# Altium project try 2.PrjPcb
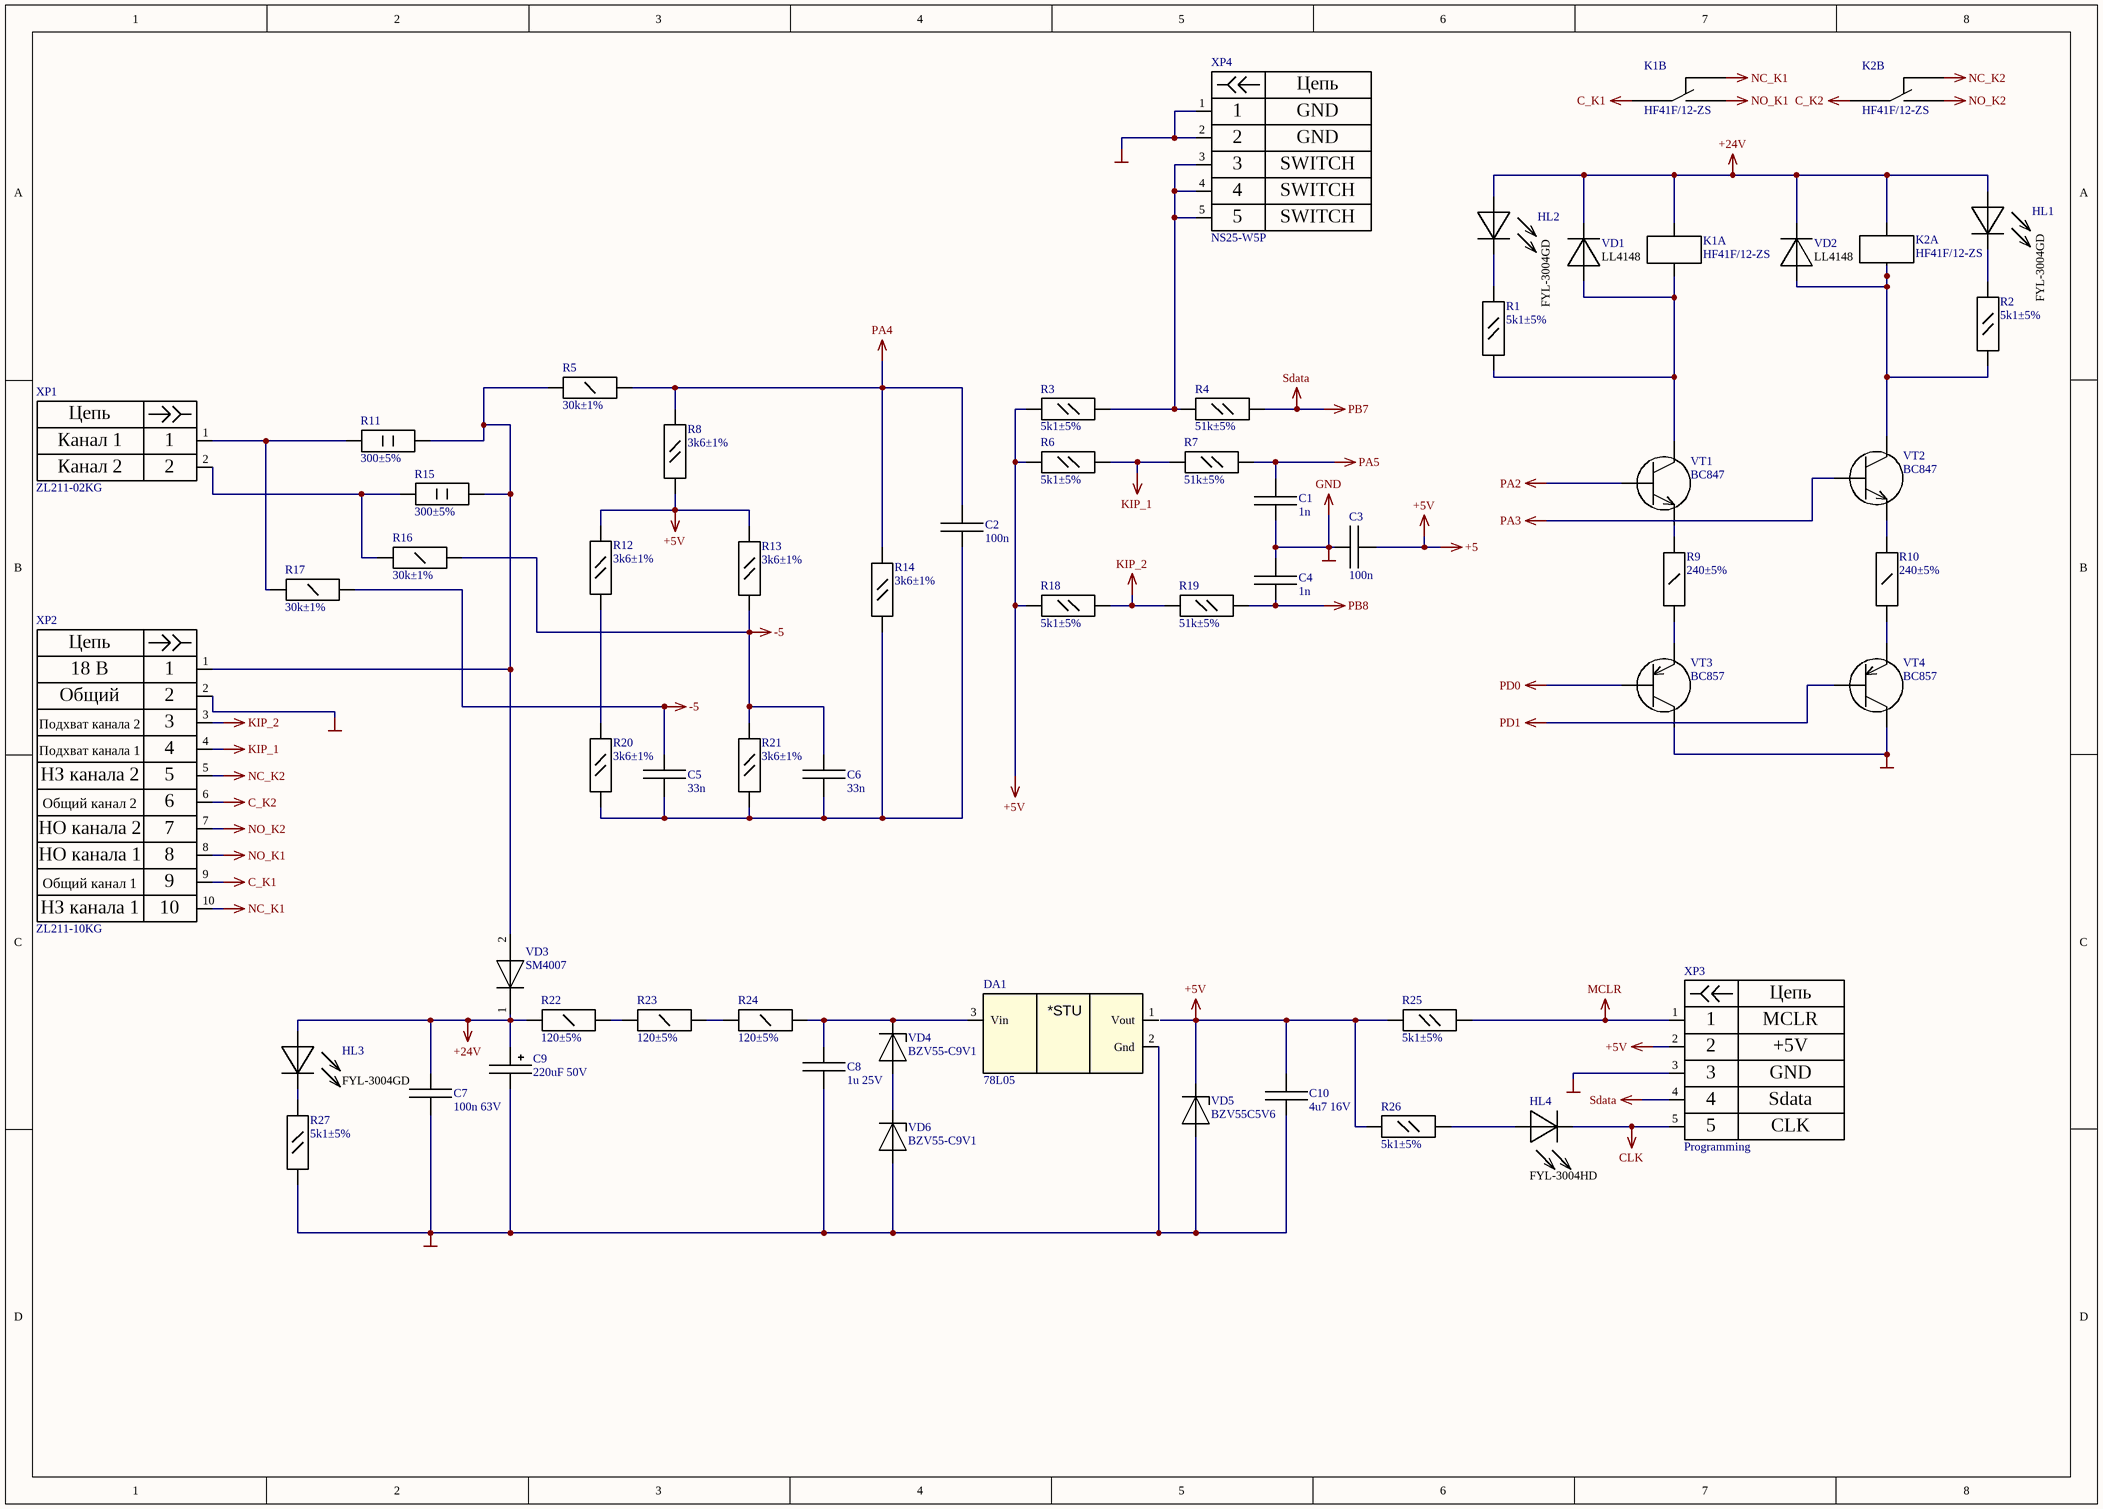
[diagram p0: Sheet2.SchDoc]
2 sheets, 59 parts. Net scope: global (net labels, ports and power ports of the same name join across sheets).
Board file: PCB1.PcbDoc
Sheets:
  Sheet2.SchDoc
  Sheet3.SchDoc

## Sheet Sheet2.SchDoc
size A3; SheetNumber: 1; SheetTotal: 2

### Parts
C1  1n  [Cap Ceramic 0805]
C2  100n  [Cap Ceramic 0805]
C3  100n  [Cap Ceramic 0805]
C4  1n  [Cap Ceramic 0805]
C5  33n  [Cap Ceramic 0805]
C6  33n  [Cap Ceramic 0805]
C7  100n 63V  [Cap Ceramic 0805]
C8  1u 25V  [Cap Ceramic 0805]
C9  220uF 50V  [Cap electro d5x2.05mm]
C10  4u7 16V  [Cap Ceramic 0805]
DA1  78L05  [SOT-89]
HL1  FYL-3004GD  [LED 0805]
HL2  FYL-3004GD  [LED 0805]
HL3  FYL-3004GD  [LED 0805]
HL4  FYL-3004HD  [LED 0805]
K1  HF41F/12-ZS  [HF41F_12-ZS]  (parts A,B of 2)
K2  HF41F/12-ZS  [HF41F_12-ZS]  (parts A,B of 2)
R1  5k1±5%  [Resistor 0805]
R2  5k1±5%  [Resistor 0805]
R3  5k1±5%  [Resistor 0805]
R4  51k±5%  [Resistor 0805]
R5  30k±1%  [Resistor 1206]
R6  5k1±5%  [Resistor 0805]
R7  51k±5%  [Resistor 0805]
R8  3k6±1%  [Resistor 0805]
R9  240±5%  [Resistor 1206]
R10  240±5%  [Resistor 1206]
R11  300±5%  [Resistor 2W d5.08x20.32 axial]
R12  3k6±1%  [Resistor 0805]
R13  3k6±1%  [Resistor 0805]
R14  3k6±1%  [Resistor 0805]
R15  300±5%  [Resistor 2W d5.08x20.32 axial]
R16  30k±1%  [Resistor 1206]
R17  30k±1%  [Resistor 1206]
R18  5k1±5%  [Resistor 0805]
R19  51k±5%  [Resistor 0805]
R20  3k6±1%  [Resistor 0805]
R21  3k6±1%  [Resistor 0805]
R22  120±5%  [Resistor 1206]
R23  120±5%  [Resistor 1206]
R24  120±5%  [Resistor 1206]
R25  5k1±5%  [Resistor 0805]
R26  5k1±5%  [Resistor 0805]
R27  5k1±5%  [Resistor 0805]
VD1  LL4148  [SOD80C]
VD2  LL4148  [SOD80C]
VD3  SM4007  [SM4007]
VD4  BZV55-C9V1  [BZV55C9V1]
VD5  BZV55C5V6  [BZV55C5V6]
VD6  BZV55-C9V1  [BZV55C9V1]
VT1  BC847  [SOT-23-3]
VT2  BC847  [SOT-23-3]
VT3  BC857  [SOT-23-3]
VT4  BC857  [SOT-23-3]
XP1  ZL211-02KG  Name1: Канал 1  Name: Цепь  Name2: Канал 2  [Pins 1x2]
XP2  ZL211-10KG  Name1: 18 В  Name2: Общий  Name3: Подхват канала 2  Name: Цепь  Name4: Подхват канала 1  Name5: НЗ канала 2  Name6: Общий канал 2  Name7: НО канала 2  Name8: НО канала 1  Name9: Общий канал 1  Name10: НЗ канала 1  [Pins 1x10]
XP3  Programming  Name1: MCLR  Name: Цепь  Name2: +5V  Name3: GND  Name4: Sdata  Name5: CLK  [WF-05]
XP4  NS25-W5P  Name1: GND  Name: Цепь  Name3: SWITCH  [WF-05]

### Nets
+5: C3.2 C10.2 R3.1 R6.1 R8.1 R12.2 R13.2 R18.1 R25.1 R26.1 VD5.9 XP3.2  [also labelled +5V]
+24V: C7.1 C9.2 HL1.1(A) HL2.1(A) HL3.1(A) K1.10 K2.10 R22.1 VD1.2(K) VD2.2(K) VD3.1
-5: C1.1 C3.1 C4.2 C5.1 C6.1 C7.2 C8.2 C9.1 C10.1 DA1.2(Gnd) R13.1 R16.2 R17.2 R21.2 R27.1 VD5.8 VD6.8 VT3.3(K) VT4.3(K) XP2.2 XP3.3 XP4.1 XP4.2  [also labelled GND]
C_K1: K1.14 XP2.9
C_K2: K2.14 XP2.6
CLK: HL4.2(K) XP3.5
KIP_1: R6.2 R7.1 XP2.4
KIP_2: R18.2 R19.1 XP2.3
MCLR: R25.2 XP3.1
NC_K1: K1.12 XP2.10
NC_K2: K2.12 XP2.5
NO_K1: K1.13 XP2.8
NO_K2: K2.13 XP2.7
PA2: VT1.1(B)
PA3: VT2.1(B)
PA4: C2.2 R5.2 R8.2 R14.2
PA5: C1.2 R7.2
PB7: R4.2 XP3.4  [also labelled Sdata]
PB8: C4.1 R19.2
PD0: VT3.1(B)
PD1: VT4.1(B)
NetC2_1: C2.1 C5.2 C6.2 R14.1 R20.1 R21.1
NetC8_1: C8.1 DA1.3(Vin) R24.2 VD4.9
NetHL1_2: HL1.2(K) R2.2
NetHL2_2: HL2.2(K) R1.2
NetHL3_2: HL3.2(K) R27.2
NetHL4_1: HL4.1(A) R26.2
NetK1_11: K1.11 R1.1 VD1.1(A) VT1.3(K)
NetK2_11: K2.11 R2.1 VD2.1(A) VT2.3(K)
NetR3_2: R3.2 R4.1 XP4.3 XP4.4 XP4.5
NetR5_1: R5.1 R11.2 R15.2 VD3.2 XP2.1
NetR9_1: R9.1 VT3.2(E)
NetR9_2: R9.2 VT1.2(E)
NetR10_1: R10.1 VT4.2(E)
NetR10_2: R10.2 VT2.2(E)
NetR11_1: R11.1 R17.1 XP1.1
NetR12_1: R12.1 R20.2
NetR15_1: R15.1 R16.1 XP1.2
NetR22_2: R22.2 R23.1
NetR23_2: R23.2 R24.1
NetVD4_8: VD4.8 VD6.9

Not connected (* = marked no-connect by the designer): DA1 1(Vout)

### Notes on the sheet
- (in symbol 78L05) *STU

### Library data of the parts
C1-C8 C10 = CerCap: Comments: *
C9 = ECap: Comments: *
HL1-HL4 = LED: Comments: *
K1 K2 = HF41F_12-ZS
R1-R4 R6-R8 R12-R14 R18-R21 R25-R27 = Resistor 0,125W: Comments: *
R5 R16 R17 = Resistor 0.5W
R9 R10 R22-R24 = Resistor 0,25W: Comments: *
R11 R15 = Resistor 2W: Comments: *
VD4 VD6 = BZV55C9V1
XP1 = Pins 1x2: Comments: *
XP2 = Pins 1x10: Comments: *
XP3 XP4 = Pins 1x5: Comments: *
  XP4: Name2: GND; Name4: SWITCH; Name5: SWITCH
DA1 = 78L05: Comments: *
VD1 VD2 = LL4148: Comments: *
VT1 VT2 = BC847: Comments: *
VT3 VT4 = BC857: Comments: *

## Sheet Sheet3.SchDoc
size A3; SheetNumber: 2; SheetTotal: 2
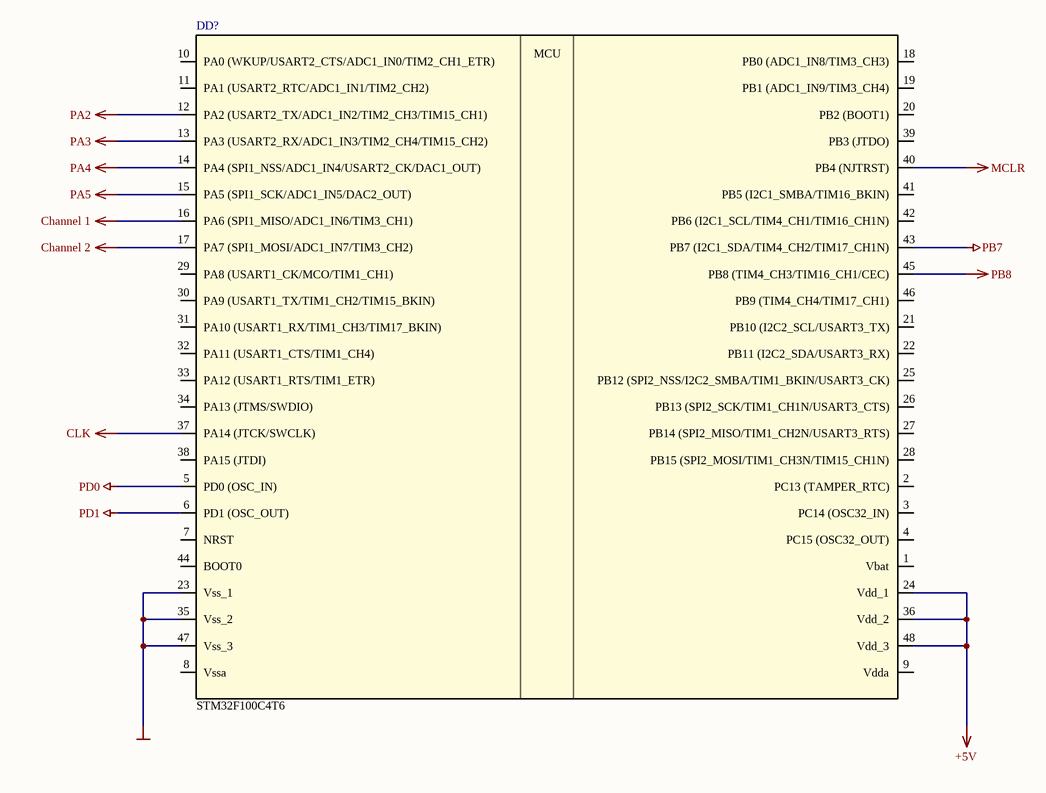
[diagram p1: Sheet3.SchDoc]

### Parts
DD?  STM32F100C4T6  [TQFP48 S0.5]

### Nets
+5V: DD?.24(Vdd_1) DD?.36(Vdd_2) DD?.48(Vdd_3)  [project net +5]
-5: DD?.23(Vss_1) DD?.35(Vss_2) DD?.47(Vss_3)
Channel 1: DD?.16(PA6_(SPI1_MISO/ADC1_IN6/TIM3_CH1))
Channel 2: DD?.17(PA7_(SPI1_MOSI/ADC1_IN7/TIM3_CH2))
CLK: DD?.37(PA14_(JTCK/SWCLK))
MCLR: DD?.40(PB4_(NJTRST))
PA2: DD?.12(PA2_(USART2_TX/ADC1_IN2/TIM2_CH3/TIM15_CH1))
PA3: DD?.13(PA3_(USART2_RX/ADC1_IN3/TIM2_CH4/TIM15_CH2))
PA4: DD?.14(PA4_(SPI1_NSS/ADC1_IN4/USART2_CK/DAC1_OUT))
PA5: DD?.15(PA5_(SPI1_SCK/ADC1_IN5/DAC2_OUT))
PB7: DD?.43(PB7_(I2C1_SDA/TIM4_CH2/TIM17_CH1N))
PB8: DD?.45(PB8_(TIM4_CH3/TIM16_CH1/CEC))
PD0: DD?.5(PD0_(OSC_IN))
PD1: DD?.6(PD1_(OSC_OUT))

Not connected (* = marked no-connect by the designer): DD? 1(Vbat) 2(PC13_(TAMPER_RTC)) 3(PC14_(OSC32_IN)) 4(PC15_(OSC32_OUT)) 7(NRST) 8(Vssa) 9(Vdda) 10(PA0_(WKUP/USART2_CTS/ADC1_IN0/TIM2_CH1_ETR)) 11(PA1_(USART2_RTC/ADC1_IN1/TIM2_CH2)) 18(PB0_(ADC1_IN8/TIM3_CH3)) 19(PB1_(ADC1_IN9/TIM3_CH4)) 20(PB2_(BOOT1)) 21(PB10_(I2C2_SCL/USART3_TX)) 22(PB11_(I2C2_SDA/USART3_RX)) 25(PB12_(SPI2_NSS/I2C2_SMBA/TIM1_BKIN/USART3_CK)) 26(PB13_(SPI2_SCK/TIM1_CH1N/USART3_CTS)) 27(PB14_(SPI2_MISO/TIM1_CH2N/USART3_RTS)) 28(PB15_(SPI2_MOSI/TIM1_CH3N/TIM15_CH1N)) 29(PA8_(USART1_CK/MCO/TIM1_CH1)) 30(PA9_(USART1_TX/TIM1_CH2/TIM15_BKIN)) 31(PA10_(USART1_RX/TIM1_CH3/TIM17_BKIN)) 32(PA11_(USART1_CTS/TIM1_CH4)) 33(PA12_(USART1_RTS/TIM1_ETR)) 34(PA13_(JTMS/SWDIO)) 38(PA15_(JTDI)) 39(PB3_(JTDO)) 41(PB5_(I2C1_SMBA/TIM16_BKIN)) 42(PB6_(I2C1_SCL/TIM4_CH1/TIM16_CH1N)) 44(BOOT0) 46(PB9_(TIM4_CH4/TIM17_CH1))

### Notes on the sheet
- (in symbol STM32F100C4T6) MCU

## Nets that join several sheets
+5: Sheet2 (12 pins), Sheet3 (DD?.24 DD?.36 DD?.48)
-5: Sheet2 (23 pins), Sheet3 (DD?.23 DD?.35 DD?.47)
CLK: Sheet2 (HL4.2 XP3.5), Sheet3 (DD?.37)
MCLR: Sheet2 (R25.2 XP3.1), Sheet3 (DD?.40)
PA2: Sheet2 (VT1.1), Sheet3 (DD?.12)
PA3: Sheet2 (VT2.1), Sheet3 (DD?.13)
PA4: Sheet2 (C2.2 R5.2 R8.2 R14.2), Sheet3 (DD?.14)
PA5: Sheet2 (C1.2 R7.2), Sheet3 (DD?.15)
PB7: Sheet2 (R4.2 XP3.4), Sheet3 (DD?.43)
PB8: Sheet2 (C4.1 R19.2), Sheet3 (DD?.45)
PD0: Sheet2 (VT3.1), Sheet3 (DD?.5)
PD1: Sheet2 (VT4.1), Sheet3 (DD?.6)